# EAGLE design Cartev1 (EAGLE 6.5.0)
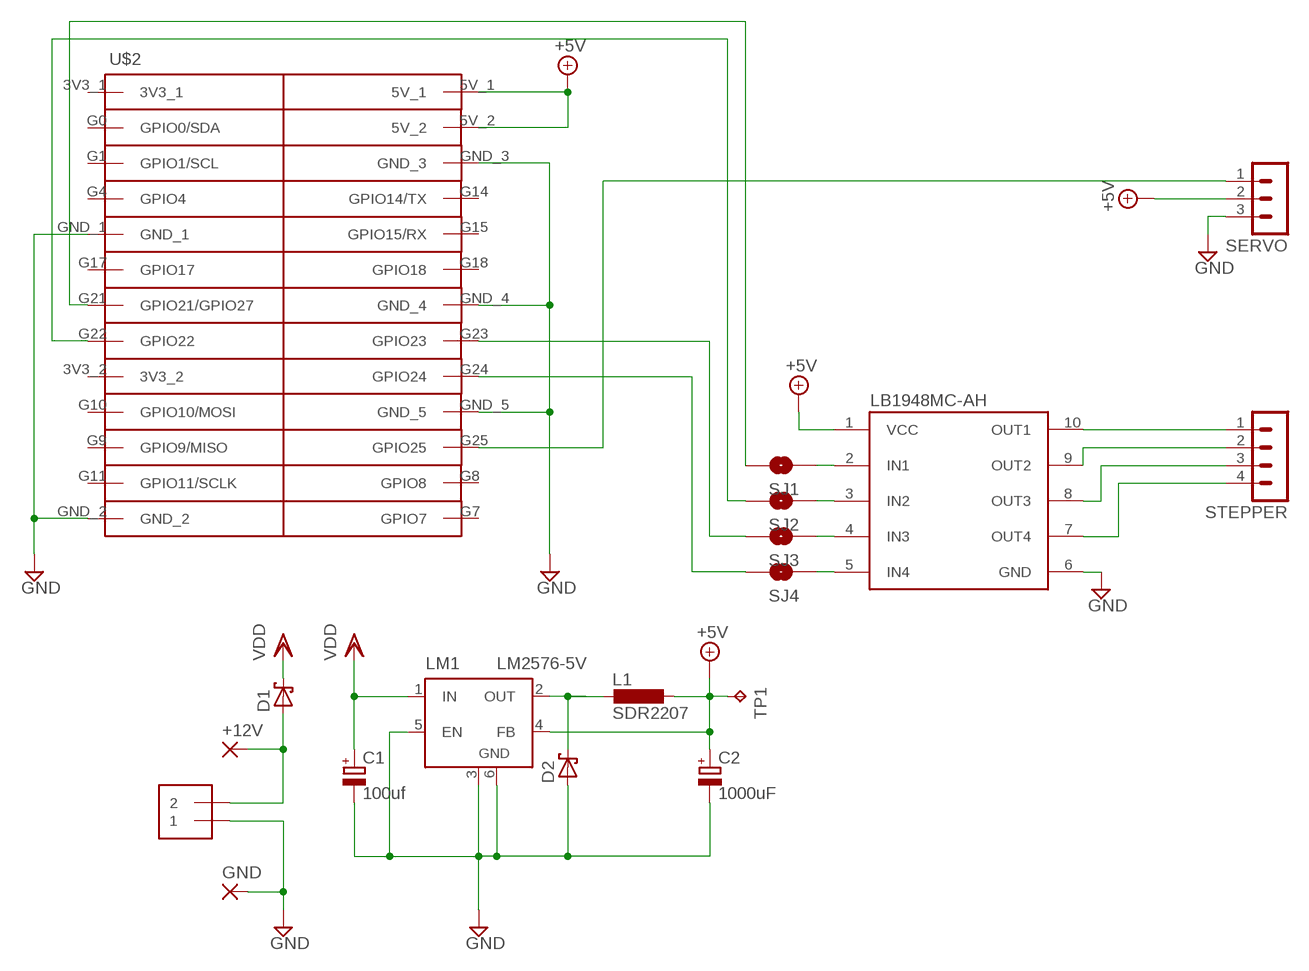
[diagram p0: schematic, sheet 1]

## Parts
+12V  3,81/1,4  [3,81/1,4]
C1  100uf  CPOL-EUE  [PANASONIC_E]
C2  1000uF  CPOL-EUG  [PANASONIC_G]
D1  SCHOTTKY-DIODESMC  [SMC]
D2  SCHOTTKY-DIODESMC  [SMC]
GND  3,81/1,4  [3,81/1,4]
J1  1X2-3.5MM  [3.5MMTERM]
L1  SDR2207  [SM]
LB1948MC-AH  LB1948MC-AH  [SOIC-10]
LM1  LM2576-5V  LM2596S  [TO263-5]
SERVO  MA03-1  [MA03-1]
SJ1  SOLDERJUMPERTRACE  [SJ_2S-TRACE]
SJ2  SOLDERJUMPERTRACE  [SJ_2S-TRACE]
SJ3  SOLDERJUMPERTRACE  [SJ_2S-TRACE]
SJ4  SOLDERJUMPERTRACE  [SJ_2S-TRACE]
STEPPER  MA04-1  [MA04-1]
TP1  TPTP10SQ  [TP10SQ]
U$2  CONNECTEUR_RPI  [26PIN]

## Nets
+5V: C2.+ L1.P$2 LB1948MC-AH.1(VCC) LM1.4(FB) SERVO.2 TP1.TP U$2.5V_1 U$2.5V_2
GND: C1.- C2.- D2.A GND.1(P) J1.1 LB1948MC-AH.6(GND) LM1.3(GND) LM1.5(EN) LM1.6(GND) SERVO.3 U$2.GND_1 U$2.GND_2 U$2.GND_3 U$2.GND_4 U$2.GND_5
N$1: LB1948MC-AH.10(OUT1) STEPPER.1
N$2: LB1948MC-AH.9(OUT2) STEPPER.2
N$3: LB1948MC-AH.8(OUT3) STEPPER.3
N$4: LB1948MC-AH.7(OUT4) STEPPER.4
N$5: +12V.1(P) D1.A J1.2
N$6: D2.C L1.P$1 LM1.2(OUT)
N$7: LB1948MC-AH.2(IN1) SJ1.1
N$8: LB1948MC-AH.3(IN2) SJ2.1
N$9: LB1948MC-AH.4(IN3) SJ3.1
N$10: LB1948MC-AH.5(IN4) SJ4.1
N$11: SERVO.1 U$2.G25(GPIO25)
N$12: SJ1.2 U$2.G21(GPIO21/GPIO27)
N$13: SJ2.2 U$2.G22(GPIO22)
N$14: SJ3.2 U$2.G23(GPIO23)
N$15: SJ4.2 U$2.G24(GPIO24)
VDD: C1.+ D1.C LM1.1(IN)
Unconnected: U$2.3V3_1 U$2.3V3_2 U$2.G0(GPIO0/SDA) U$2.G1(GPIO1/SCL) U$2.G4(GPIO4) U$2.G7(GPIO7) U$2.G8(GPIO8) U$2.G9(GPIO9/MISO) U$2.G10(GPIO10/MOSI) U$2.G11(GPIO11/SCLK) U$2.G14(GPIO14/TX) U$2.G15(GPIO15/RX) U$2.G17(GPIO17) U$2.G18(GPIO18)

## Library data of the parts
+12V GND = wirepad:3,81/1,4: THROUGH-HOLE PAD
C1 C2 = rcl:CPOL-EU: POLARIZED CAPACITOR, European symbol
D1 D2 = diode:SCHOTTKY-DIODE: Schottky Diode
J1 = adafruit (2):1X2: 3.5mm Terminal block http://www.ladyada.net/library/pcb/eaglelibrary.html
L1 = bourns-inductor:SDR2207
LB1948MC-AH = LB1948MC:LB1948MC-AH
LM1 = linear:LM2596S: STEP-DOWN VOLTAGE REGULATOR
SERVO = con-lstb:MA03-1: PIN HEADER; OC_FARNELL: unknown; OC_NEWARK: unknown
SJ1-SJ4 = SparkFun-Passives:SOLDERJUMPER: Solder Jumper Standard SMD solder jumper. Used to automate production. Two varients : Normally Open and Normally Closed are the same, but have different paste layers. NC will have a large amount of paste and should jumper during reflow.
STEPPER = con-lstb:MA04-1: PIN HEADER; OC_FARNELL: unknown; OC_NEWARK: unknown
TP1 = testpad:TP: Test pad
U$2 = Rpi:CONNECTEUR_RPI

## Board
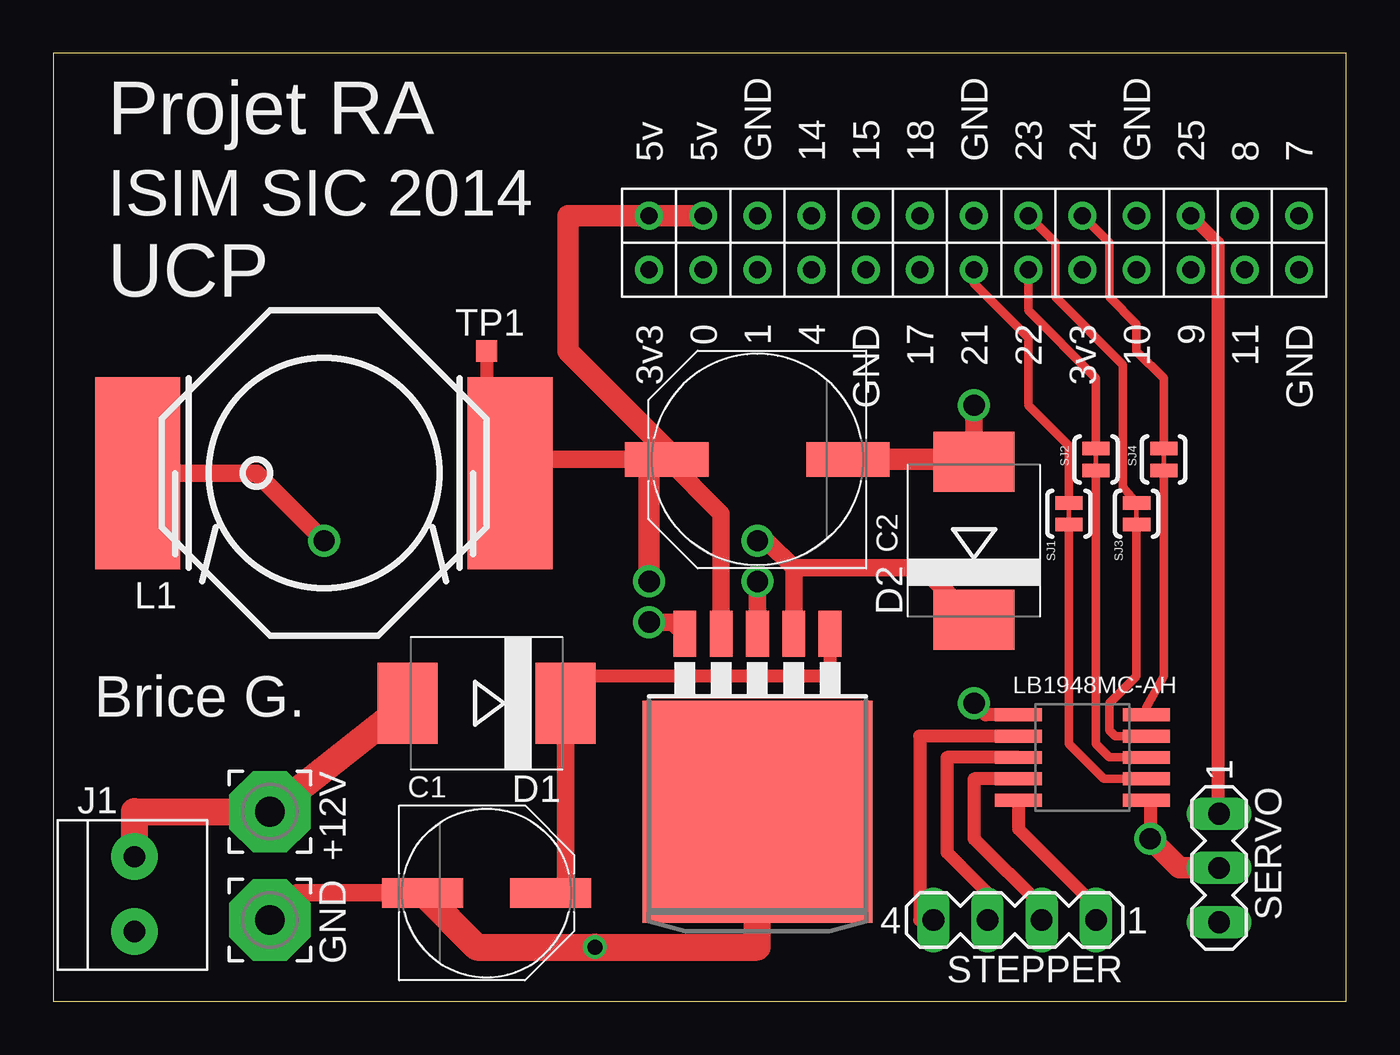
[diagram p1: board, top side]
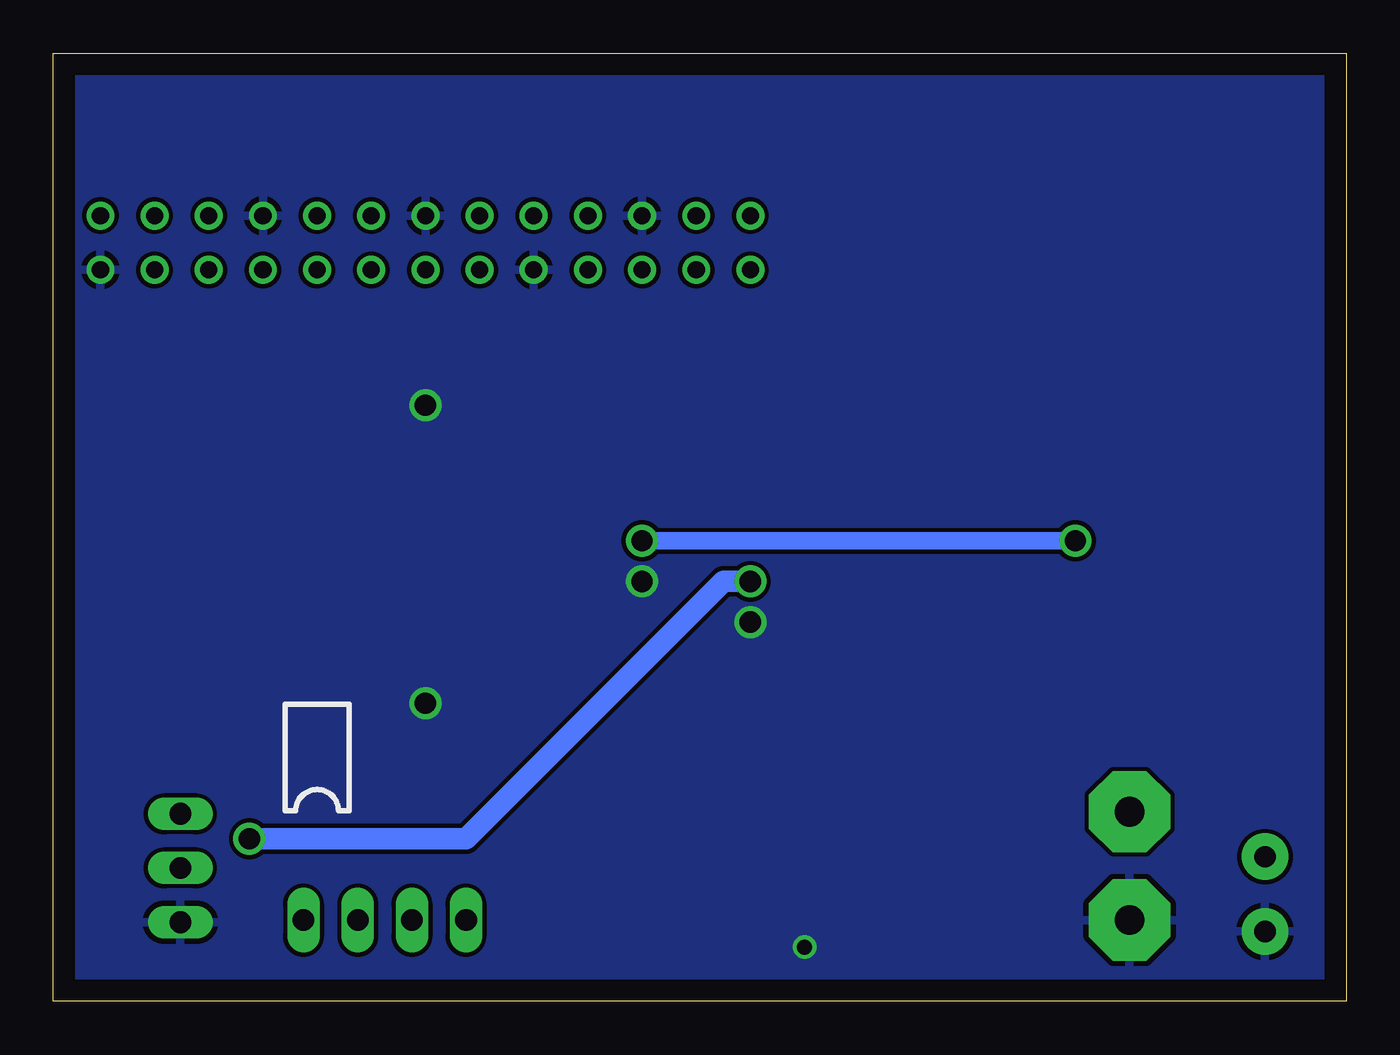
[diagram p2: board, bottom side, seen from below]

Size 60.63 x 44.44 mm. Coordinates in mm from the lower left corner, seen from the top.
Outline: 0,0 60.63,0 60.63,44.44 0,44.44 0,0
Copper layers (1*16): Top 0.035mm / dielectric 1.5mm / Bottom 0.035mm
Design rules "default *": minimum track width 0.2mm, minimum drill 0.3mm, track to track 8mil, track to pad 8mil, pad to pad 8mil, via to via 8mil, smd to smd 8mil, copper to edge 40mil, drill to drill 8mil, minimum pad ring 10mil, minimum via ring 8mil, stop-mask expansion 4mil, vias tented up to drill 0mil, thermal gap 10mil

### Footprints (pad centres in the part's own frame; a part is rotated, then mirrored left to right if it is on the bottom)
3,81/1,4 = drill 1.397 pad 3.81 octagon: 1 0,0
PANASONIC_E = smd 3.8 x 1.4: + 3,0; - -3,0
PANASONIC_G = smd 3.9 x 1.6: + 4.25,0; - -4.25,0
SMC = smd 2.8 x 3.8: A 3.7,0; C -3.7,0
3.5MMTERM = drill 1 pad 2.184: 1 1.8,0; 2 -1.7,0
SM = smd 4 x 9: P$1 -8.74,0; P$2 8.72,0
SOIC-10 = smd 2.2 x 0.6: 1 -3,2; 2 -3,1; 3 -3,0; 4 -3,-1; 5 -3,-2; 6 3,-2; 7 3,-1; 8 3,0; 9 3,1; 10 3,2
TO263-5 = smd 1.067 x 2.159: 1 -3.404,-5.791; 2 -1.702,-5.791; 3 0,-5.791; 4 1.702,-5.791; 5 3.404,-5.791 | smd 10.8 x 10.41: 6 0,2.54
MA03-1 = drill 1.016 long: 1 -2.54,0; 2 0,0; 3 2.54,0
SJ_2S-TRACE = smd 0.635 x 1.27: 1 -0.508,0; 2 0.508,0
MA04-1 = drill 1.016 long: 1 -3.81,0; 2 -1.27,0; 3 1.27,0; 4 3.81,0
TP10SQ = smd 1 x 1: TP 0,0
26PIN = drill 0.8: 3V3_1 -1.27,15.24; 3V3_2 -1.27,-5.08; 5V_1 1.27,15.24; 5V_2 1.27,12.7; G0 -1.27,12.7; G1 -1.27,10.16; G4 -1.27,7.62; G7 1.27,-15.24; G8 1.27,-12.7; G9 -1.27,-10.16; G10 -1.27,-7.62; G11 -1.27,-12.7; G14 1.27,7.62; G15 1.27,5.08; G17 -1.27,2.54; G18 1.27,2.54; G21 -1.27,0; G22 -1.27,-2.54; G23 1.27,-2.54; G24 1.27,-5.08; G25 1.27,-10.16; GND_1 -1.27,5.08; GND_2 -1.27,-15.24; GND_3 1.27,10.16; GND_4 1.27,0; GND_5 1.27,-7.62

### Placement (x,y rotation side)
+12V  10.16,8.89 270 top
C1  20.32,5.08 0 top
C2  33.02,25.4 180 top
D1  20.32,13.97 180 top
D2  43.18,21.59 90 top
GND  10.16,3.81 270 top
J1  3.81,5.08 270 top
L1  12.7,24.77 0 top
LB1948MC-AH  48.26,11.43 180 top
LM1  33.02,11.43 180 top
SERVO  54.67,6.25 270 top
SJ1  47.62,22.86 90 top
SJ2  48.9,25.4 90 top
SJ3  50.8,22.86 90 top
SJ4  52.07,25.4 90 top
STEPPER  45.09,3.81 180 top
TP1  20.32,30.48 90 top
U$2  43.18,35.56 90 top

### Tracks (layer width: path | path; a pad name or v marks a point on that pad's centre or on a via)
+5V  (via drill 1)
  Top 0.61: TP1.TP 20.32,24.77 L1.P$2 | LB1948MC-AH.1 51.44,9.43 v51.44,7.62
  Top 0.813: LM1.4 31.32,22.85 C2.+ 27.94,25.4 22.86,25.4 22.69,25.57 L1.P$2
  Top 1.016: v27.94,19.68 27.94,25.4 29.21,25.4 24.13,30.48 24.13,36.83 U$2.5V_1 U$2.5V_2 | v51.44,7.62 52.8,6.25 SERVO.2
  Bottom 1.016: v27.94,19.68 29.21,19.68 41.27,7.62 v51.44,7.62
GND  (via drill 0.7, 1)
  Top 0.61: 29.62,7.62 33.02,7.62 | LB1948MC-AH.6 43.72,13.43 v43.18,13.97
  Top 0.813: LM1.5 29.06,17.78 v27.94,17.78 | D2.A v43.18,27.94 | LM1.3 v33.02,19.68 | C1.- 11.43,5.08 GND.1
  Top 1.016: C2.- 43.18,25.4 D2.A
  Top 1.27: C1.- 19.86,2.54 v25.4,2.54 33.02,2.54 33.02,7.62 LM1.6
  pour Bottom: 60.96,45.72 -1.27,45.72 -1.27,-1.27 60.96,-1.27
N$1
  Top 0.61: LB1948MC-AH.10 45.26,8.08 48.9,4.45 STEPPER.1
N$2
  Top 0.61: LB1948MC-AH.9 43.18,10.43 43.18,7.62 46.35,4.45 STEPPER.2
N$3
  Top 0.61: LB1948MC-AH.8 41.91,11.43 41.91,6.99 43.81,5.08 STEPPER.3
N$4
  Top 0.61: LB1948MC-AH.7 40.64,12.43 40.64,3.81 STEPPER.4
N$5
  Top 1.27: J1.2 3.81,8.89 +12V.1 D1.A
N$6  (via drill 1)
  Top 0.813: 34.72,20.32 LM1.2 | D2.C 40.75,20.32 34.72,20.32 | 34.72,20.32 33.45,21.59 v33.02,21.59 | v12.7,21.59 9.53,24.77 L1.P$1
  Bottom 0.813: v33.02,21.59 v12.7,21.59
N$7
  Top 0.406: LB1948MC-AH.2 49.26,10.43 47.62,12.06 SJ1.1
N$8
  Top 0.406: LB1948MC-AH.3 49.53,11.43 48.9,12.06 SJ2.1
N$9
  Top 0.406: LB1948MC-AH.4 49.8,12.43 49.53,12.7 49.53,13.97 50.8,15.24 SJ3.1
N$10
  Top 0.406: LB1948MC-AH.5 51.26,13.79 52.07,15.24 SJ4.1
N$11
  Top 0.61: U$2.G25 54.61,35.56 54.61,8.85 SERVO.1
N$12
  Top 0.406: SJ1.2 47.62,26.04 45.72,27.94 45.72,31.11 43.18,33.66 U$2.G21
N$13
  Top 0.406: SJ2.2 48.9,29.21 45.72,32.38 U$2.G22
N$14
  Top 0.406: SJ3.2 50.16,24.13 50.16,29.84 46.99,33.02 46.99,35.56 U$2.G23
N$15
  Top 0.406: SJ4.2 52.07,29.21 50.8,30.48 50.8,31.75 49.53,33.02 49.53,35.56 U$2.G24
VDD
  Top 0.61: LM1.1 36.42,15.24 25.29,15.24 D1.C | 24.02,5.19 23.43,5.19 C1.+
  Top 0.813: D1.C 24.02,5.19 24.13,5.08

### Text on the board
tPlace: Projet RA | ISIM SIC 2014 | UCP | Brice G.